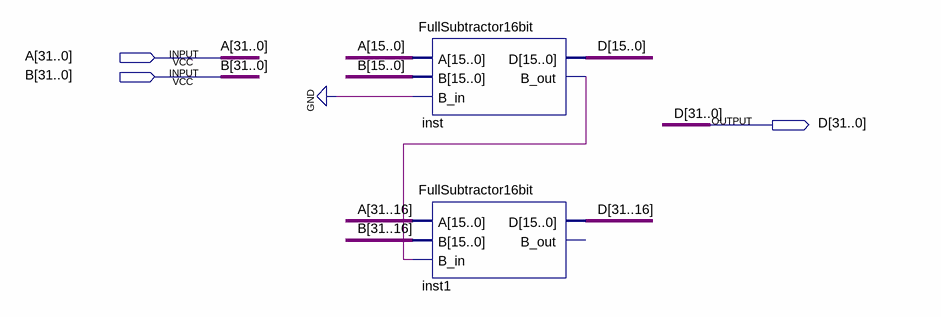
[diagram p0: schematic sheet]
// Quartus schematic SUB-32bits.bdf as structural Verilog: 2 symbols, 3 pins
module \SUB-32bits  (
  input  [31:0] A,
  input  [31:0] B,
  output [31:0] D
);

  wire inst_b_out;

  FullSubtractor16bit inst (.A(A[15:0]), .B(B[15:0]), .B_in(1'b0), .D(D[15:0]), .B_out(inst_b_out));
  FullSubtractor16bit inst1 (.A(A[31:16]), .B(B[31:16]), .B_in(inst_b_out), .D(D[31:16]));  // open: B_out
endmodule
